# EAGLE design Rubik_servos_2 (EAGLE 6.2)
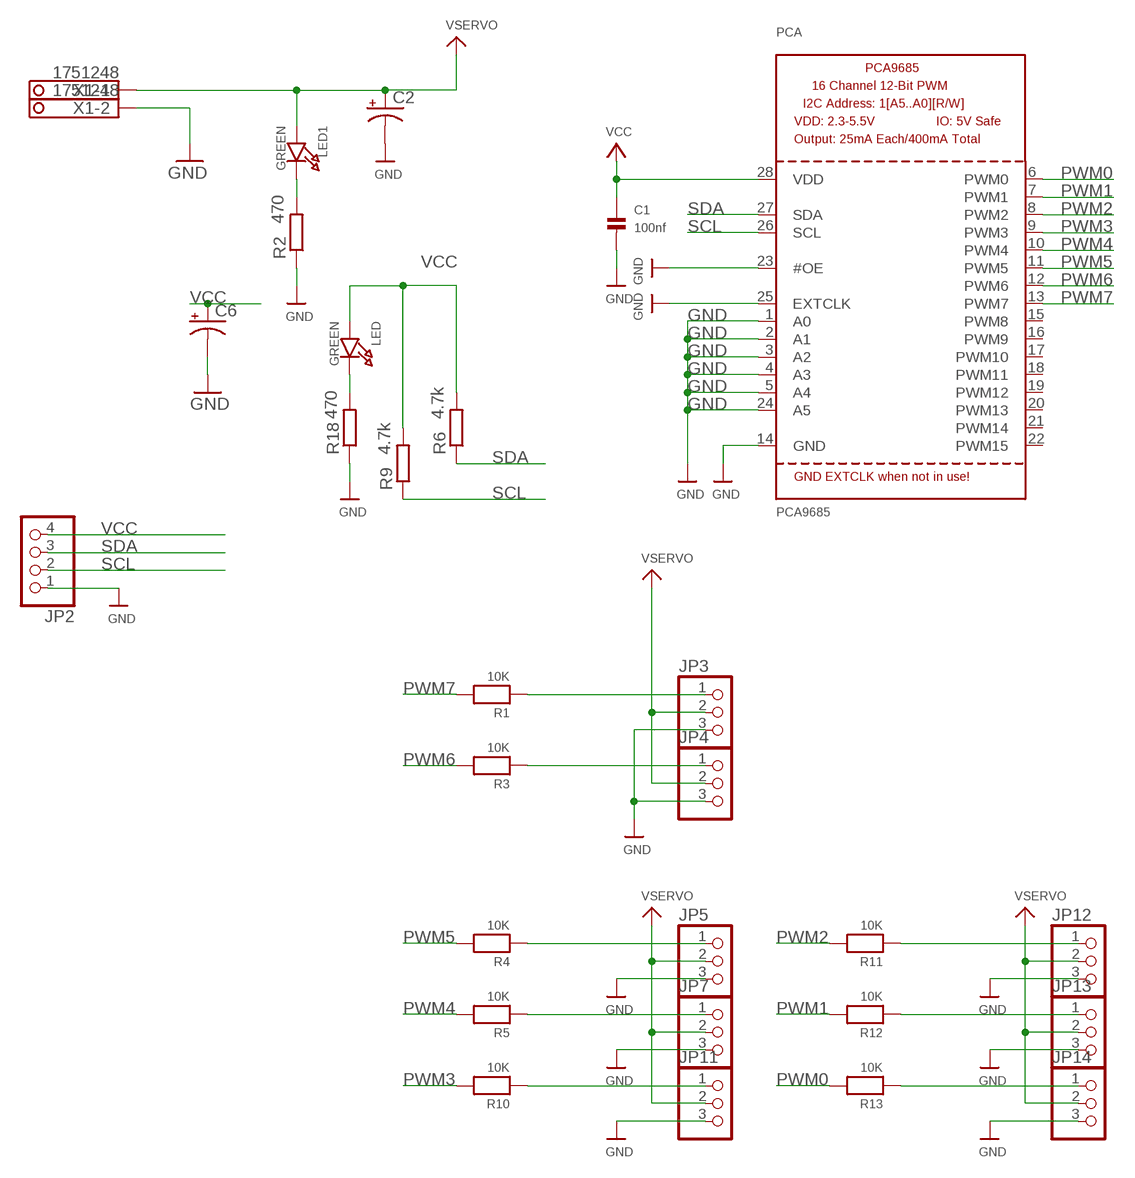
[diagram p0: schematic, sheet 1]

## Parts
C1  100nf  CAP_CERAMIC0805  [0805]
C2  CPOL-USE3.5-8  [E3,5-8]
C6  CAP_POL3528  [EIA3528]
JP2  PINHD-1X4"  [1X04]
JP3  PINHD-1X3CB  [1X03-CLEANBIG]
JP4  PINHD-1X3CB  [1X03-CLEANBIG]
JP5  PINHD-1X3CB  [1X03-CLEANBIG]
JP7  PINHD-1X3CB  [1X03-CLEANBIG]
JP11  PINHD-1X3CB  [1X03-CLEANBIG]
JP12  PINHD-1X3CB  [1X03-CLEANBIG]
JP13  PINHD-1X3CB  [1X03-CLEANBIG]
JP14  PINHD-1X3CB  [1X03-CLEANBIG]
LED  GREEN  LED0805  [CHIPLED_0805]
LED1  GREEN  LED0805  [CHIPLED_0805]
PCA  PCA9685  [TSSOP28]
R1  10K  RESISTOR0603  [0603]
R2  470  R-EU_R0805  [R0805]
R3  10K  RESISTOR0603  [0603]
R4  10K  RESISTOR0603  [0603]
R5  10K  RESISTOR0603  [0603]
R6  4.7k  R-EU_R0603  [R0603]
R9  4.7k  R-EU_R0603  [R0603]
R10  10K  RESISTOR0603  [0603]
R11  10K  RESISTOR0603  [0603]
R12  10K  RESISTOR0603  [0603]
R13  10K  RESISTOR0603  [0603]
R18  470  R-EU_R0805  [R0805]
X1  1751248  [1751248]

## Nets
GND: C1.2 C2.- C6.C(-) JP2.1 JP3.3 JP4.3 JP5.3 JP7.3 JP11.3 JP12.3 JP13.3 JP14.3 PCA.1(A0) PCA.2(A1) PCA.3(A2) PCA.4(A3) PCA.5(A4) PCA.14(GND) PCA.23(#OE) PCA.24(A5) PCA.25(EXTCLK) R2.1 R18.1 X1.2
N$1: JP3.1 R1.1
N$2: JP4.1 R3.1
N$3: LED1.C R2.2
N$4: JP5.1 R4.1
N$5: JP7.1 R5.1
N$6: JP11.1 R10.1
N$8: JP12.1 R11.1
N$9: JP13.1 R12.1
N$10: JP14.1 R13.1
N$19: LED.C R18.2
PWM0: PCA.6(PWM0) R13.2
PWM1: PCA.7(PWM1) R12.2
PWM2: PCA.8(PWM2) R11.2
PWM3: PCA.9(PWM3) R10.2
PWM4: PCA.10(PWM4) R5.2
PWM5: PCA.11(PWM5) R4.2
PWM6: PCA.12(PWM6) R3.2
PWM7: PCA.13(PWM7) R1.2
SCL: JP2.2 PCA.26(SCL) R9.1
SDA: JP2.3 PCA.27(SDA) R6.1
VCC: C1.1 C6.A(+) JP2.4 LED.A PCA.28(VDD) R6.2 R9.2
VSERVO: C2.+ JP3.2 JP4.2 JP5.2 JP7.2 JP11.2 JP12.2 JP13.2 JP14.2 LED1.A X1.1
Unconnected: PCA.15(PWM8) PCA.16(PWM9) PCA.17(PWM10) PCA.18(PWM11) PCA.19(PWM12) PCA.20(PWM13) PCA.21(PWM14) PCA.22(PWM15)

## Library data of the parts
C1 = microbuilder:CAP_CERAMIC: Ceramic Capacitors 0402 - 0402 Surface Mount Capacitors 16pF 50V 5% [Digikey: 445-4899-2-ND] 18pF 50V 5% [Digikey: 490-1281-2-ND] 22pF 50V 5% [Digikey: 490-1283-2-ND] 68pF 50V 5% [Digikey: 490-1289-2-ND] 0.1uF 10V 10% [Digikey: 490-1318-2-ND] 1.0uF 6.3V 10% [Digikey: 490-1320-2-ND] 0603 - 0603 Surface Mount Capacitors 16 pF 50V 5% [Digikey: 445-5051-2-ND] 22 pF 50V [Digikey: PCC220ACVTR-ND] 33 pF 50V 5% [Digikey: 490-1415-1-ND] 56pF 50V 5% [Digikey: 490-1421-1-ND] 220pF 50V 5% [Digikey: 445-1285-1-ND] 680 pF 50V 2200 pF 50V 5% C0G [Digikey: 445-1297-1-ND] 5600 pF 100V 5% X7R [Digikey: 478-3711-1-ND] 0.1 µF 25V 10% [Digikey: PCC2277TR-ND] 0.22 µF 16V 10% X7R [Digikey: 445-1318-1-ND] 1.0 µF 25V 10% [Digikey: 445-5146-2-ND] 0603 - RF Specific 3pF 250V +/-0.1pF RF [Digikey: 712-1347-1-ND] 18 pF 250V 5% [Digikey: 478-3505-1-ND or 712-1322-1-ND] 56 pF 250V 5% C0G RF [Digikey: 490-4867-1-ND] 68 pF 250V RF [Digikey: 490-4868-1-ND] 0805 - 0805 Surface Mount Capacitors 220 pF 250V 2% RF Ceramic Capacitor [Digikey: 712-1398-1-ND] 1000 pF 50V 2% NP0 Ceramic Capacitor [Digikey: 478-3760-1-ND] 0.1 µF 25V 10% Ceramic Capacitor [Digikey: PCC1828TR-ND] 1.0 µF 16V 10% Ceramic Capacitor[Digikey: 490-1691-2-ND] 10.0 µF 10V 10% Ceramic Capacitor[Digikey: 709-1228-1-ND] 10.0 uF 16V 10% Ceramic Capacitor [Digikey: 478-5165-2-ND] 47 uF 6.3V 20% Ceramic Capacitor [Digikey: 587-1779-1-ND or 399-5506-1-ND] 1206 - 1206 Surface Mount Capacitors 47uF 10V 20% Ceramic Capacitor [Digikey: 490-5528-1-ND or 399-5508-1-ND or 445-6010-1-ND] 100uF 6.3V -20%, +80% Y5V Ceramic Capacitor (Digikey: 490-4512-1-ND, Mouser: 81-GRM31CF50J107ZE1L)
C2 = adafruit:CPOL-US: POLARIZED CAPACITOR, American symbol
C6 = SparkFun:CAP_POL: Capacitor Polarized These are standard SMD and PTH capacitors. Normally 10uF, 47uF, and 100uF in electrolytic and tantalum varieties. Always verify the external diameter of the through hole cap, it varies with capacity, voltage, and manufacturer. The EIA devices should be standard.
JP2 = pinhead:PINHD-1X4: PIN HEADER
JP3-JP5 JP7 JP11-JP14 = adafruit:PINHD-1X3: PIN HEADER
LED LED1 = microbuilder:LED: LED 0603 - 0603 Surface Mount Package 2mA: Green LED - Low Power (3.9mcd, 2ma, 1.7Vf) - Digikey: 475-2709-2-ND Orange LED - Low Power (9.8mcd, 2ma, 1.8Vf) - Digikey: 475-1194-2-ND Red LED - Low Power (5mcd, 2ma, 1.8Vf) - Digikey: 475-1195-2-ND Yellow LED - Low Power (7mcd, 2ma, 1.8Vf) - Digikey: 475-1196-2-ND 5mA: Blue LED - Low Power (17mcd, 5ma, 2.9Vf) - Digikey: LNJ937W8CRACT-ND 0805 - 0805 Surface Mount Package 2mA: Red LED (8.8mcd, 2mA, 1.8Vf, Clear) - Low Power [Digikey: 475-2510-1-ND] Green LED (5mcd, 2mA, 1.8Vf, Clear) - Low Power [Digikey: 475-2730-1-ND] Yellow LED (11.3mcd, 2mA, 1.8Vf, Clear) - Low Power [Digikey: 475-2555-1-ND] 20mA: Red LED (104mcd, 20mA, Diffused) - LS R976 [Digikey: 475-1278-6-ND] Red LED (12mcd, 20mA, 2.0Vf, Clear) - APT2012EC [Digikey: 754-1128-1-ND] Green LED (15mcd, 20mA, 2.2Vf, Clear) - APT2012GC [Digikey: 754-1131-1-ND] Orange LED (160mcd, 20mA, 2.1Vf, Clear) - APT2012SECK [Digikey: 754-1130-1-ND] 1206 - 1206 Surface Mount Package Green LED (26mcd, 20mA, Diffused) - LG N971 [Digikey: 475-1407-6-ND] Red LED (15mcd, 20mA, Diffused) - LH N974 [Digikey: 475-1416-6-ND]
PCA = microbuilder:PCA9685: PCA9685 - 16 Channel 12-Bit I2C PWM Controller 5.0V tolerant 16 channel, 12-bit I2C PWM controller with 25mA per output (max. 400mA total) Digikey: 568-5931-1-ND
R1 R3-R5 R10-R13 = microbuilder:RESISTOR: Resistors 0402 - 0402 Surface Mount Package 22 Ohm 1% 1/16W [Digikey: 311-22.0LRTR-ND] 33 Ohm 5% 1/16W 1.0K 5% 1/16W 1.5K 5% 1/16W 2.0K 1% 1/16W 10.0K 1% 1/16W [Digikey: 311-10.0KLRTR-ND] 10.0K 5% 1/16W [Digikey: RMCF0402JT10K0TR-ND] 12.1K 1% 1/16W [Digikey: 311-22.0LRTR-ND] 100.0K 5% 1/16W 0603 - 0603 Surface Mount Package 0 Ohm 1/10 Watt 1% Resistor 15 Ohm 1/10 Watt 1% Resistor 33 Ohm 1/10 Watt 1% Resistor 49.9 Ohm 1/10 Watt 1% Resistor 100 Ohm 1/10 Watt 1% Resistor 150 Ohm 1/10 Watt 1% Resistor 240 Ohm 1/10 Watt 1% Resistor 390 Ohm 1/10 Watt 1% Resistor 560 Ohm 1/10 Watt 1% Resistor 680 Ohm 1/10 Watt 1% Resistor 750 Ohm 1/10 Watt 1% Resistor 1.0K Ohm 1/10 Watt 1% Resistor 1.5K Ohm 1/10 Watt 1% Resistor 2.0K Ohm 1/10 Watt 1% Resistor 2.2K Ohm 1/10 Watt 1% Resistor 3.3K Ohm 1/10 Watt 1% Resistor 4.7K Ohm 1/10 Watt 1% Resistor 10.0K Ohm 1/10 Watt 1% Resistor 12.0K Ohm 1/10 Watt 1% Resistor 12.1K Ohm 1/10 Watt 1% Resistor 20.0K Ohm 1/10 Watt 1% Resistor 33.0K Ohm 1/10 Watt 1% Resistor 100.0K Ohm 1/10 Watt 1% Resistor 0805 - 0805 Surface Mount Package 0 Ohm 1/8 Watt 1% Resistor 33 Ohm 1/8 Watt 1% Resistor 100 Ohm 1/8 Watt 1% Resistor 150 Ohm 1/8 Watt 1% Resistor 200 Ohm 1/8 Watt 1% Resistor 240 Ohm 1/8 Watt 1% Resistor 330 Ohm 1/8 Watt 1% Resistor 390 Ohm 1/8 Watt 1% Resistor 470 Ohm 1/8 Watt 1% Resistor 1.0K Ohm 1/8 Watt 1% Resistor 1.5K Ohm 1/8 Watt 1% Resistor 2.0K Ohm 1/8 Watt 1% Resistor 4.7K Ohm 1/8 Watt 1% Resistor 5.1K Ohm 1/8 Watt 1% Resistor 5.6K Ohm 1/8 Watt 1% Resistor 10.0K Ohm 1/8 Watt 1% Resistor 22.0K Ohm 1/8 Watt 1% Resistor 33.0K Ohm 1/8 Watt 1% Resistor 100K Ohm 1/8 Watt 1% Resistor 1206 - 1206 Surface Mount Package 2012 - 2010 Surface Mount Package 0.11 Ohm 1/2 Watt 1% Resistor - Digikey: RHM.11UCT-ND
R2 R6 R9 R18 = rcl:R-EU_: RESISTOR, European symbol
X1 = con-phoenix-350:1751248: MKDS 1/ 2-3,5 Printklemme Nennstrom: 10 A Bemessungsspannung: 160 V Raster: 3,5 mm Polzahl: 2 Montageart: Löten Anschlussart: Schraubanschluss Anschlussrichtung vom Leiter zur Platine: 0° Source: http://eshop.phoenixcontact.com .. 1751248.pdf

## Board
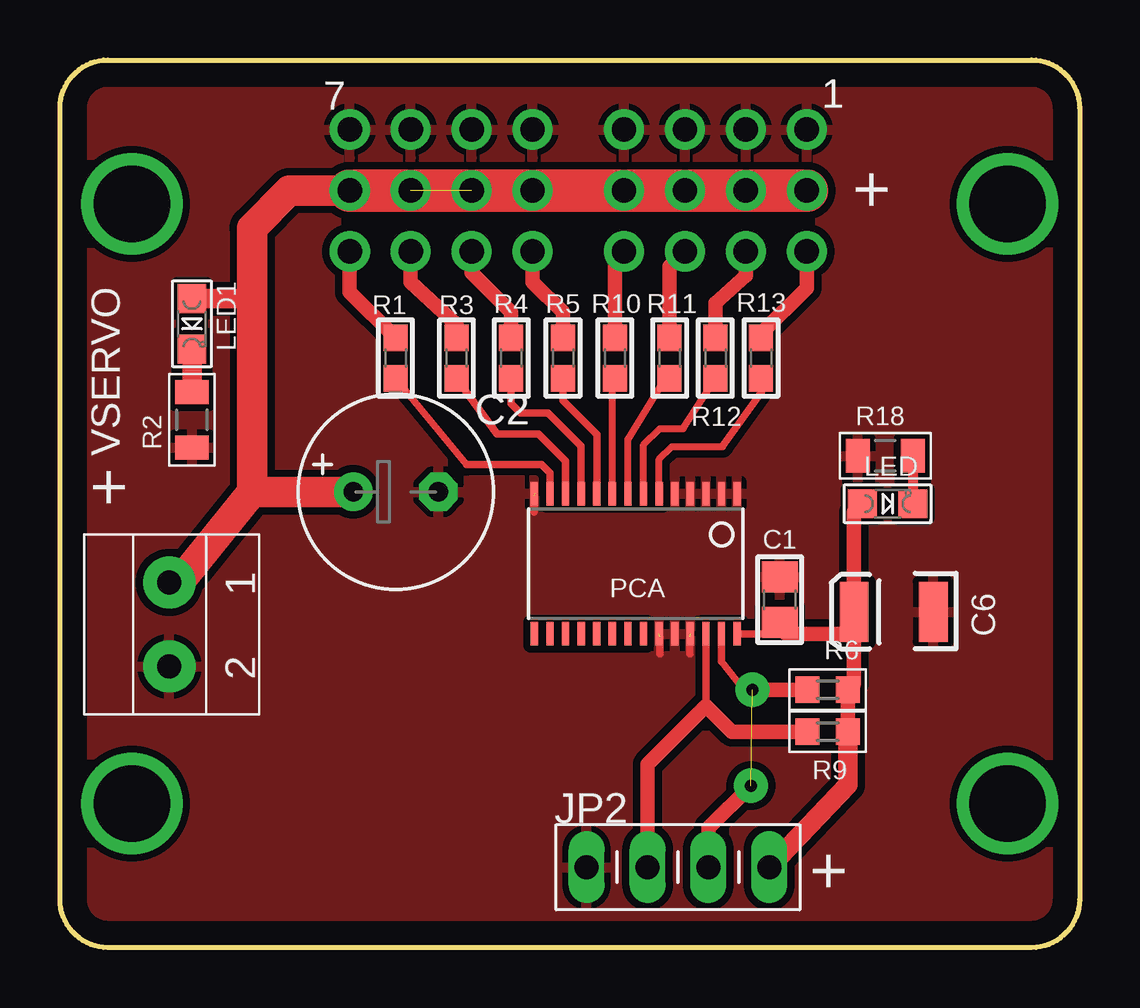
[diagram p1: board, top side]

Size 42.5 x 37 mm. Coordinates in mm from the lower left corner, seen from the top.
Outline: 2,37 40.5,37 arc-90 42.5,35 42.5,2 arc-90 40.5,0 2,0 arc-90 0,2 0,35 arc-90 2,37
Copper layers (1*16): Top 0.035mm / dielectric 1.5mm / Bottom 0.035mm
Design rules: minimum track width 10mil, minimum drill 24mil, track to track 8mil, track to pad 8mil, pad to pad 8mil, via to via 8mil, smd to smd 8mil, copper to edge 40mil, drill to drill 8mil, minimum pad ring 10mil, minimum via ring 8mil, stop-mask expansion 4mil, vias tented up to drill 0mil, thermal gap 10mil

### Footprints (pad centres in the part's own frame; a part is rotated, then mirrored left to right if it is on the bottom)
0805 = smd 1.3 x 1.5: 1 -0.95,0; 2 0.95,0
E3,5-8 = drill 0.813 pad 1.6: + -1.778,0 | drill 0.813 pad 1.6 octagon: - 1.778,0
EIA3528 = smd 1.2 x 2.5: A 1.65,0; C -1.65,0
1X04 = drill 1 long: 1 -3.81,0; 2 -1.27,0; 3 1.27,0; 4 3.81,0
1X03-CLEANBIG = drill 1.016 pad 1.676: 1 -2.54,0; 2 0,0; 3 2.54,0
CHIPLED_0805 = smd 1.2 x 1.2: A 0,-1.05; C 0,1.05
TSSOP28 = smd 0.305 x 0.991: 1 -4.225,-2.918; 2 -3.575,-2.918; 3 -2.925,-2.918; 4 -2.275,-2.918; 5 -1.625,-2.918; 6 -0.975,-2.918; 7 -0.325,-2.918; 8 0.325,-2.918; 9 0.975,-2.918; 10 1.625,-2.918; 11 2.275,-2.918; 12 2.925,-2.918; 13 3.575,-2.918; 14 4.225,-2.918; 15 4.225,2.918; 16 3.575,2.918; 17 2.925,2.918; 18 2.275,2.918; 19 1.625,2.918; 20 0.975,2.918; 21 0.325,2.918; 22 -0.325,2.918; 23 -0.975,2.918; 24 -1.625,2.918; 25 -2.275,2.918; 26 -2.925,2.918; 27 -3.575,2.918; 28 -4.225,2.918
0603 = smd 1.1 x 1: 1 -0.85,0; 2 0.85,0
R0805 = smd 1 x 1.4: 1 -1.15,0; 2 1.15,0
R0603 = smd 1 x 1.1: 1 -0.85,0; 2 0.85,0
1751248 = drill 1 pad 2.184: 1 -1.75,-0.1; 2 1.75,-0.1

### Placement (x,y rotation side)
C1  30,14.5 90 top
C2  14,19 0 top
C6  34.75,14 180 top
JP2  25.76,3.35 0 top
JP3  12.08,31.56 90 top
JP4  14.62,31.56 90 top
JP5  17.16,31.56 90 top
JP7  19.7,31.56 90 top
JP11  23.51,31.56 90 top
JP12  26.05,31.56 90 top
JP13  28.59,31.56 90 top
JP14  31.13,31.56 90 top
LED  34.5,18.5 270 top
LED1  5.5,26 180 top
PCA  24,16 180 top
R1  13.98,24.57 270 top
R2  5.5,22 90 top
R3  16.52,24.57 270 top
R4  18.81,24.57 270 top
R5  20.97,24.57 270 top
R6  32,10.75 0 top
R9  32,9 0 top
R10  23.13,24.57 270 top
R11  25.41,24.57 270 top
R12  27.32,24.57 270 top
R13  29.23,24.57 270 top
R18  34.4,20.5 0 top
X1  4.66,13.47 270 top

### Tracks (layer width: path | path; a pad name or v marks a point on that pad's centre or on a via)
GND  (3 unrouted)
  Top 0.305: 19.75,18.85 19.75,18.15 | 25,12.95 25,12.25 | 26.25,12.95 26.25,12.25
  pour Top (isolate 0.305): 0,37 42.5,37 42.5,0.5 0,0.5
N$1
  Top 0.61: JP3.1 12.08,27.33 R1.1
N$2
  Top 0.406: 16.52,25.97 R3.1
  Top 0.61: JP4.1 14.62,27.75 16.52,25.97
N$3
  Top 0.813: R2.2 LED1.C
N$4
  Top 0.4: 18.85,25.27 R4.1
  Top 0.61: JP5.1 17.16,28.13 18.81,26.48 R4.1
N$5
  Top 0.61: JP7.1 19.7,27.75 20.97,26.48 R5.1
N$6
  Top 0.61: R10.1 23.13,28.39 JP11.1
N$7  (via drill 3.2)
  other vias: 39.5,6
N$8
  Top 0.61: R11.1 25.41,28.39 JP12.1
N$9
  Top 0.61: R12.1 27.32,26.86 28.59,28 JP13.1
N$10
  Top 0.406: R13.1 29.23,25.59
  Top 0.61: 29.23,25.59 31.13,27.5 JP14.1
N$11  (via drill 3.2)
  other vias: 3,6
N$15  (via drill 3.2)
  other vias: 39.5,31
N$17  (via drill 3.2)
  other vias: 3,31
N$19
  Top 0.406: R18.2 LED.C
PWM0
  Top 0.3: PCA.6 24.98,20.36 25.5,20.89 27.62,20.89 29.25,23.14 R13.2
PWM1
  Top 0.3: PCA.7 24.32,20.96 25,21.64 25.97,21.64 R12.2
PWM2
  Top 0.3: PCA.8 23.68,21.18 25.25,23.77 25.5,23.77 R11.2
PWM3
  Top 0.3: PCA.9 23.02,23.52 R10.2
PWM4
  Top 0.305: PCA.10 22.38,21.39 20.97,22.8 R5.2
PWM5
  Top 0.305: PCA.11 21.73,20.9 20.34,22.29 19.19,22.29 18.81,22.67 R4.2
PWM6
  Top 0.305: PCA.12 21.07,20.28 19.95,21.4 18.21,21.4 R3.2
PWM7
  Top 0.305: PCA.13 20.43,19.79 20.08,20.13 16.95,20.13 R1.2
SCL
  Top 0.305: PCA.26 26.93,10.07
  Top 0.61: R9.1 28,9 26.93,10.07 24.49,7.64 JP2.2
SDA  (via drill 0.5 pad 1.42)  (1 unrouted)
  Top 0.305: PCA.27 27.57,11.93 28.5,10.75 v28.87,10.75
  Top 0.61: R6.1 v28.87,10.75 | JP2.3 27.03,4.98 v28.8,6.75
VCC
  Top 0.305: PCA.28 30.28,13.08 C1.1
  Top 0.406: 33.1,18.15 LED.A | 33.1,11 R6.2 | 33.02,13.08 33.1,13 | 33.12,9.28 R9.2
  Top 0.61: 30.28,13.08 33.02,13.08 | R9.2 R6.2 | 33.1,18.15 C6.A 33.1,13 33.1,11
  Top 0.813: R9.2 32.85,6.78 JP2.4
VSERVO  (1 unrouted)
  Top 0.813: LED1.A 7.95,27.05 8,27
  Top 1.27: JP3.2 9.56,31.56 8,30 8,27 8,19 | 8,19 C2.+ | 8,19 4.78,15 X1.1
  Top 1.778: JP14.2 JP13.2 JP12.2 JP11.2 JP7.2 JP5.2 JP3.2

### Text on the board
tPlace: 7 | 1 | + | VSERVO | + | +